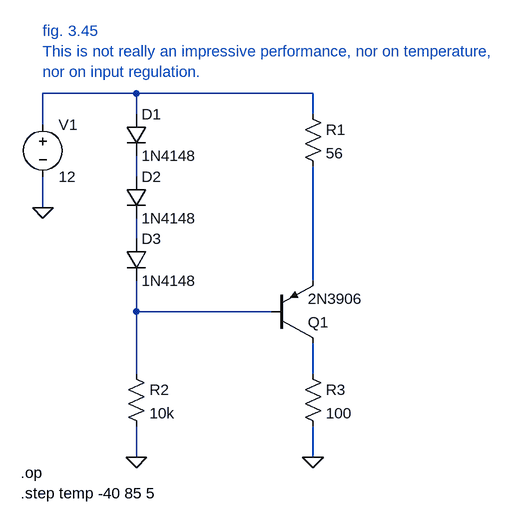
[diagram p0: schematic RSGB_current_source.asc]
RSGB_current_source.asc, the LTspice schematic file:
Version 4
SHEET 1 1148 680
WIRE 208 16 64 16
WIRE 480 16 208 16
WIRE 208 48 208 16
WIRE 480 48 480 16
WIRE 64 64 64 16
WIRE 208 144 208 112
WIRE 64 192 64 144
WIRE 208 240 208 208
WIRE 480 304 480 128
WIRE 208 352 208 304
WIRE 416 352 208 352
WIRE 208 448 208 352
WIRE 480 448 480 400
WIRE 208 576 208 528
WIRE 480 576 480 528
FLAG 208 576 0
FLAG 64 192 0
FLAG 480 576 0
SYMBOL voltage 64 48 R0
SYMATTR InstName V1
SYMATTR Value 12
SYMBOL diode 192 48 R0
SYMATTR InstName D1
SYMATTR Value 1N4148
SYMBOL diode 192 144 R0
SYMATTR InstName D2
SYMATTR Value 1N4148
SYMBOL diode 192 240 R0
SYMATTR InstName D3
SYMATTR Value 1N4148
SYMBOL res 464 32 R0
SYMATTR InstName R1
SYMATTR Value 56
SYMBOL pnp 416 400 M180
SYMATTR InstName Q1
SYMATTR Value 2N3906
SYMBOL res 192 432 R0
SYMATTR InstName R2
SYMATTR Value 10k
SYMBOL res 464 432 R0
SYMATTR InstName R3
SYMATTR Value 100
TEXT 64 -80 Left 2 ;fig. 3.45\nThis is not really an impressive performance, nor on temperature, \nnor on input regulation.
TEXT 30 600 Left 2 !.op\n.step temp -40 85 5

The netlist it stands for:
* RSGB_current_source.asc
V1 N001 0 12
D1 N001 N002 1N4148
D2 N002 N003 1N4148
D3 N003 N005 1N4148
R1 N001 N004 56
Q1 N006 N005 N004 0 2N3906
R2 N005 0 10k
R3 N006 0 100
.model D D
.lib standard.dio
.model NPN NPN
.model PNP PNP
.lib standard.bjt
* fig. 3.45
* This is not really an impressive performance, nor on temperature,
* nor on input regulation.
.op
.step temp -40 85 5
.backanno
.end